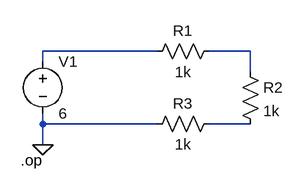
[diagram p0: schematic Simple01.asc]
Simple01.asc, the LTspice schematic file:
Version 4
SHEET 1 880 680
WIRE -32 96 -128 96
WIRE 48 96 -32 96
WIRE 176 96 128 96
WIRE 192 96 176 96
WIRE -128 112 -128 96
WIRE 192 128 192 96
WIRE -128 208 -128 192
WIRE -16 208 -128 208
WIRE 48 208 -16 208
WIRE 144 208 128 208
WIRE 192 208 144 208
WIRE -128 240 -128 208
FLAG -128 240 0
DATAFLAG 176 96 ""
DATAFLAG 144 208 ""
DATAFLAG -32 96 ""
DATAFLAG 224 128 "I(R2)"
DATAFLAG -16 208 "I(R3)"
SYMBOL res 32 112 R270
WINDOW 0 32 56 VTop 2
WINDOW 3 0 56 VBottom 2
SYMATTR InstName R1
SYMATTR Value 1k
SYMBOL res 176 112 R0
SYMATTR InstName R2
SYMATTR Value 1k
SYMBOL res 144 192 R90
WINDOW 0 0 56 VBottom 2
WINDOW 3 32 56 VTop 2
SYMATTR InstName R3
SYMATTR Value 1k
SYMBOL voltage -128 96 R0
SYMATTR InstName V1
SYMATTR Value 6
TEXT -162 264 Left 2 !.op

The netlist it stands for:
* Simple01.asc
R1 N001 N002 1k
R2 N002 N003 1k
R3 N003 0 1k
V1 N001 0 6
.op
.backanno
.end